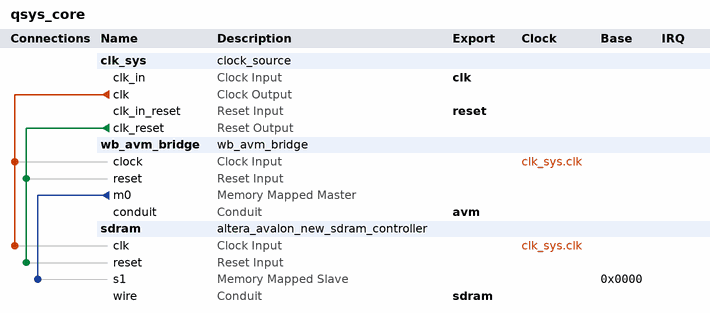
[diagram p0: system contents]
# Platform Designer (Qsys) system qsys_core, Cyclone IV E EP4CE22F17C6
# Parameters at their usual value, and those the tool derives, are not listed.
package require -exact qsys 20.1
create_system qsys_core
set_project_property DEVICE_FAMILY {Cyclone IV E}
set_project_property DEVICE EP4CE22F17C6

add_instance clk_sys clock_source 20.1
set_instance_parameter_value clk_sys clockFrequency 100000000
set_instance_parameter_value clk_sys resetSynchronousEdges DEASSERT

add_instance wb_avm_bridge wb_avm_bridge 1.0

add_instance sdram altera_avalon_new_sdram_controller 20.1
set_instance_parameter_value sdram TAC 5.5
set_instance_parameter_value sdram TRCD 20.0
set_instance_parameter_value sdram TRP 20.0
set_instance_parameter_value sdram casLatency 3
set_instance_parameter_value sdram columnWidth 9
set_instance_parameter_value sdram dataWidth 16
set_instance_parameter_value sdram generateSimulationModel false
set_instance_parameter_value sdram initRefreshCommands 8
set_instance_parameter_value sdram model custom
set_instance_parameter_value sdram numberOfBanks 4
set_instance_parameter_value sdram numberOfChipSelects 1
set_instance_parameter_value sdram powerUpDelay 200.0
set_instance_parameter_value sdram refreshPeriod 7.8125
set_instance_parameter_value sdram rowWidth 13

# connections
add_connection clk_sys.clk sdram.clk clock
add_connection clk_sys.clk wb_avm_bridge.clock clock
add_connection clk_sys.clk_reset sdram.reset reset
add_connection clk_sys.clk_reset wb_avm_bridge.reset reset
add_connection wb_avm_bridge.m0 sdram.s1 avalon
set_connection_parameter_value wb_avm_bridge.m0/sdram.s1 baseAddress 0x0000

# exported interfaces
add_interface avm conduit end
set_interface_property avm EXPORT_OF wb_avm_bridge.conduit
add_interface clk clock sink
set_interface_property clk EXPORT_OF clk_sys.clk_in
add_interface reset reset sink
set_interface_property reset EXPORT_OF clk_sys.clk_in_reset
add_interface sdram conduit end
set_interface_property sdram EXPORT_OF sdram.wire

set_interconnect_requirement {$system} qsys_mm.clockCrossingAdapter HANDSHAKE
set_interconnect_requirement {$system} qsys_mm.maxAdditionalLatency 1

save_system qsys_core.qsys
